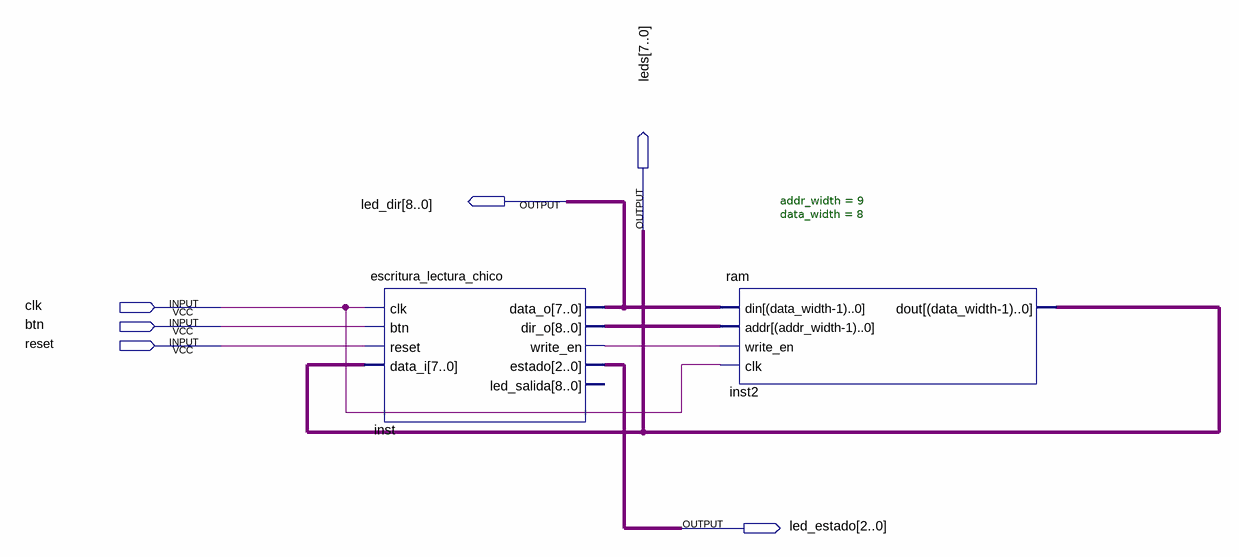
[diagram p0: schematic sheet]
// Quartus schematic Pruebas_ram_chico.bdf as structural Verilog: 2 symbols, 6 pins
module Pruebas_ram_chico (
  input  clk,
  input  btn,
  input  reset,
  output [8:0] led_dir,
  output [7:0] leds,
  output [2:0] led_estado
);

  wire inst_write_en;
  wire [8:0] inst_dir_o;

  escritura_lectura_chico inst (
    .clk(clk), .btn(btn), .reset(reset), .data_i(leds), .data_o(led_dir), .dir_o(inst_dir_o),
    .write_en(inst_write_en), .estado(led_estado));  // open: led_salida
  ram #(.addr_width(9), .data_width(8)) inst2 (
    .din(led_dir), .addr(inst_dir_o), .write_en(inst_write_en), .clk(clk), .dout(leds));
endmodule
